# Altium schematic sheet Sheet1.SchDoc
size OrCAD A; SheetNumber: 1; SheetTotal: 1
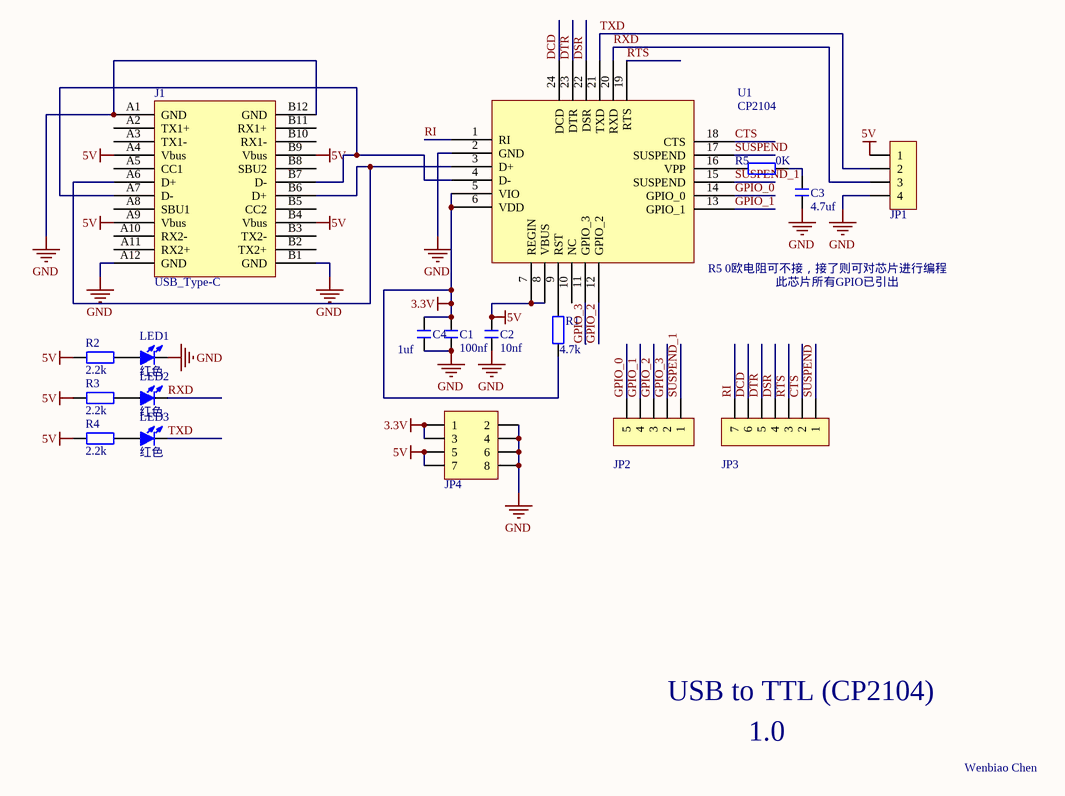
[diagram p0: Sheet1.SchDoc]

## Parts
C1  100nf  [C 0402_L]
C2  10nf  [C 0402_L]
C3  4.7uf  [C 0402_L]
C4  1uf  [C 0402_L]
J1  USB_Type-C  [Type_C-UJ31-CH-G2-SMT-TR(Primary)]
JP1  HDR-1X4  [HDR2.54-LI-4P]  (value not drawn)
JP2  HDR-1X5  [HDR2.54-LI-5P]  (value not drawn)
JP3  HDR-1X7  [HDR2.54-LI-7P]  (value not drawn)
JP4  Header 4X2  [HDR2.54-LI-2x4P]  (value not drawn)
LED1  红色  [LED 0603B]
LED2  红色  [LED 0603Y]
LED3  红色  [LED 0603G]
R1  4.7k  [R 0402_L]
R2  2.2k  [R 0402_L]
R3  2.2k  [R 0402_L]
R4  2.2k  [R 0402_L]
R5  0K  [R 0402_L]
U1  CP2104  [CP2104]

## Nets
3.3V: C1.1 C4.1 JP4.1 JP4.3 R1.2 U1.5(VIO) U1.6(VDD)
5V: C2.1 J1.A4(Vbus) J1.A9(Vbus) J1.B4(Vbus) J1.B9(Vbus) JP1.1 JP4.5 JP4.7 R2.1 R3.1 R4.1 U1.7(REGIN) U1.8(VBUS)
GND: C1.2 C2.2 C3.1 C4.2 J1.A1(GND) J1.A12(GND) J1.B1(GND) J1.B12(GND) JP1.4 JP4.2 JP4.4 JP4.6 JP4.8 LED1.2(K) U1.2(GND)
CTS: JP3.2 U1.18(CTS)
DCD: JP3.6 U1.24(DCD)
DSR: JP3.4 U1.22(DSR)
DTR: JP3.5 U1.23(DTR)
GPIO_0: JP2.5 U1.14(GPIO_0)
GPIO_1: JP2.4 U1.13(GPIO_1)
GPIO_2: JP2.3 U1.12(GPIO_2)
GPIO_3: JP2.2 U1.11(GPIO_3)
RI: JP3.7 U1.1(RI)
RTS: JP3.3 U1.19(RTS)
RXD: JP1.3 LED2.2(K) U1.20(RXD)
SUSPEND: JP3.1 U1.17(SUSPEND)
SUSPEND_1: JP2.1 U1.15(SUSPEND)
TXD: JP1.2 LED3.2(K) U1.21(TXD)
NetC3_2: C3.2 R5.2
NetJ1_A6: J1.A6(D+) J1.B6(D+) U1.3(D+)
NetJ1_A7: J1.A7(D-) J1.B7(D-) U1.4(D-)
NetLED1_1: LED1.1(A) R2.2
NetLED2_1: LED2.1(A) R3.2
NetLED3_1: LED3.1(A) R4.2
NetR1_1: R1.1 U1.9(RST)
NetR5_1: R5.1 U1.16(VPP)

Not connected (* = marked no-connect by the designer): J1 A2(TX1+) A3(TX1-) A5(CC1) A8(SBU1) A10(RX2-) A11(RX2+) B2(TX2+) B3(TX2-) B5(CC2) B8(SBU2) B10(RX1-) B11(RX1+); U1 10(NC)

## Notes on the sheet
- (near U1) R5 0欧电阻可不接，接了则可对芯片进行编程
- 此芯片所有GPIO已引出
- (near U1) VDD 为3.3V输出接口
- USB to TTL (CP2104)
- 1.0
- Wenbiao Chen

## Library data of the parts
C1-C4 = C: 贴片电容; BOM名称: 无极性贴片电容; 淘宝ID: 封装库来自淘宝 ID：黄晶宝石; 联系售后，技术支持: https://shop463601444.taobao.com; 唯一出售店铺网址: https://shop463601444.taobao.com
J1 = USB_Type-C: pin to pad: 1>A1 2>A2 3>A3 4>A4 5>A5 6>A6 7>A7 8>A8 9>A9
JP1 = Header 4: 4P接插件; 版权归属: 封装库来自淘宝 ID：黄晶宝石; BOM名称: 4P接插件; 学习资源: https://shop463601444.taobao.com
JP2 = Header 5: 5P接插件; 版权归属: 封装库来自淘宝 ID：黄晶宝石; BOM名称: 5P接插件; 学习资源: https://shop463601444.taobao.com
JP3 = Header 7: 7P接插件; 版权归属: 封装库来自淘宝 ID：黄晶宝石; BOM名称: 7P接插件; 学习资源: https://shop463601444.taobao.com
JP4 = Header 4X2: 4*2P接插件; 版权归属: 封装库来自淘宝 ID：黄晶宝石; BOM名称: 4*2P接插件; 学习资源: https://shop463601444.taobao.com
LED1-LED3 = LED-SMD: 贴片LED; 版权归属: 封装库来自淘宝 ID：黄晶宝石; BOM名称: 贴片LED; 学习资源: https://shop463601444.taobao.com
R1-R5 = R: 贴片电阻; 版权归属: 来自淘宝 ID：黄晶宝石; 封装库来自淘宝卖家 ID：黄晶宝石: 其他店铺购入均为盗版，不享受售后技术支持服务，请立即申请退款; BOM名称: 贴片电阻; 联系售后: https://shop463601444.taobao.com